# EAGLE design untitled (EAGLE 8.6.2)
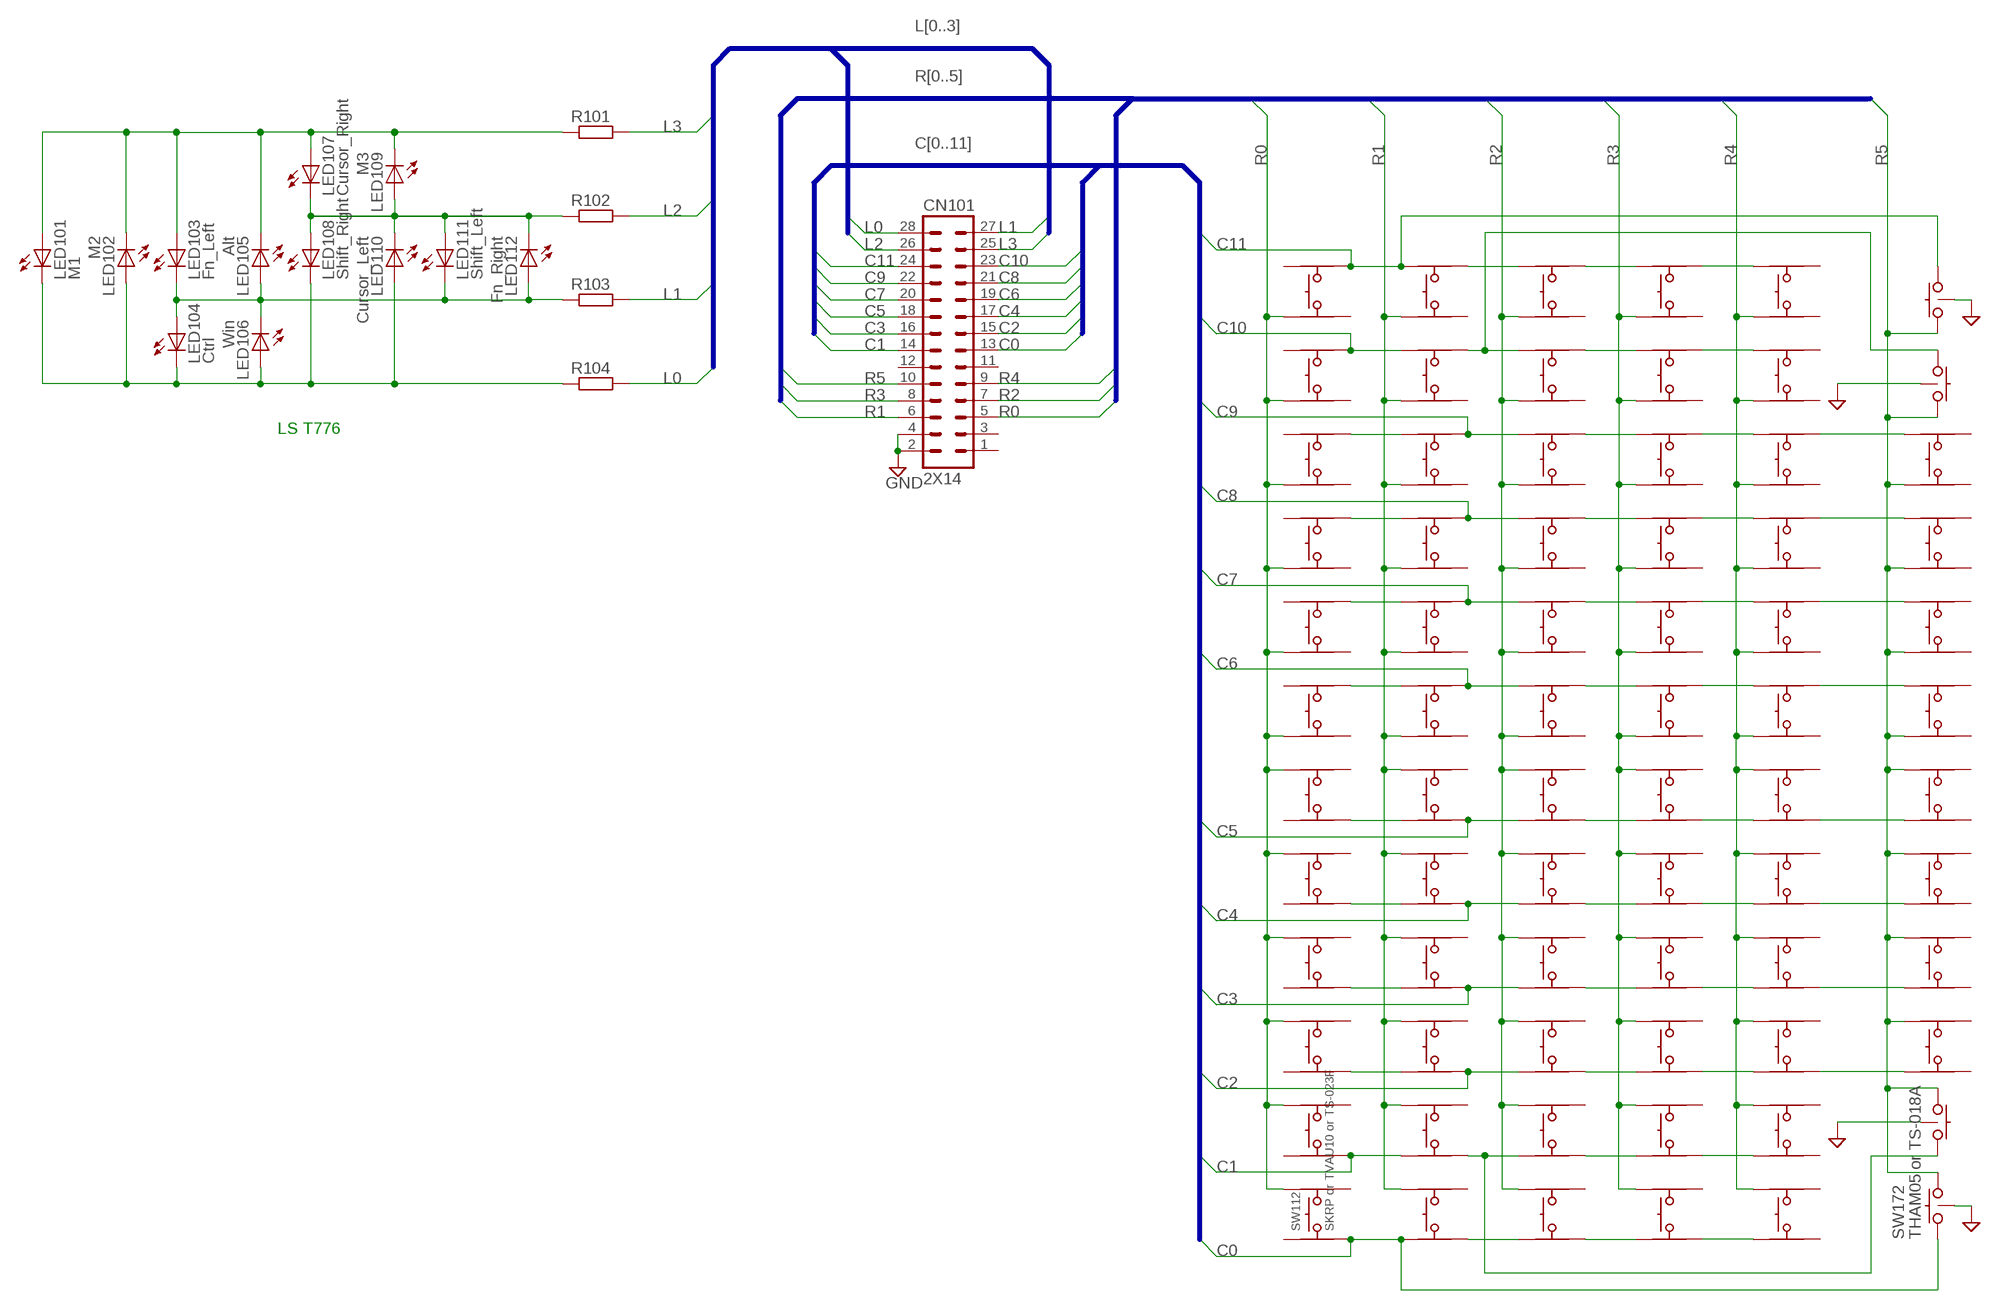
[diagram p0: schematic, sheet 1]

## Parts
CN101  2X14  [2MM_14X2]
LED101  M1  LEDP-LCC-2-BACK  [P-LCC-2-TOPLED-RG]
LED102  M2  LEDP-LCC-2-BACK  [P-LCC-2-TOPLED-RG]
LED103  Fn_Left  LEDP-LCC-2-BACK  [P-LCC-2-TOPLED-RG]
LED104  Ctrl  LEDP-LCC-2-BACK  [P-LCC-2-TOPLED-RG]
LED105  Alt  LEDP-LCC-2-BACK  [P-LCC-2-TOPLED-RG]
LED106  Win  LEDP-LCC-2-BACK  [P-LCC-2-TOPLED-RG]
LED107  Cursor_Right  LEDP-LCC-2-BACK  [P-LCC-2-TOPLED-RG]
LED108  Shift_Right  LEDP-LCC-2-BACK  [P-LCC-2-TOPLED-RG]
LED109  M3  LEDP-LCC-2-BACK  [P-LCC-2-TOPLED-RG]
LED110  Cursor_Left  LEDP-LCC-2-BACK  [P-LCC-2-TOPLED-RG]
LED111  Shift_Left  LEDP-LCC-2-BACK  [P-LCC-2-TOPLED-RG]
LED112  Fn_Right  LEDP-LCC-2-BACK  [P-LCC-2-TOPLED-RG]
R101  R-EU_R0402-SS  [R0402-SS]
R102  R-EU_R0402-SS  [R0402-SS]
R103  R-EU_R0402-SS  [R0402-SS]
R104  R-EU_R0402-SS  [R0402-SS]
SW101  SW_4PTVAU10-025  [TVAU10-025]
SW102  SW_4PTVAU10-025  [TVAU10-025]
SW103  SW_4PTVAU10-025  [TVAU10-025]
SW104  SW_4PTVAU10-025  [TVAU10-025]
SW105  SW_4PTVAU10-025  [TVAU10-025]
SW106  SW_4PTVAU10-025  [TVAU10-025]
SW107  SW_4PTVAU10-025  [TVAU10-025]
SW108  SW_4PTVAU10-025  [TVAU10-025]
SW109  SW_4PTVAU10-025  [TVAU10-025]
SW110  SW_4PTVAU10-025  [TVAU10-025]
SW111  SW_4PTVAU10-025  [TVAU10-025]
SW112  SKRP or TVAU10 or TS-023F  SW_4PTVAU10-025  [TVAU10-025]
SW113  SW_4PTVAU10-025  [TVAU10-025]
SW114  SW_4PTVAU10-025  [TVAU10-025]
SW115  SW_4PTVAU10-025  [TVAU10-025]
SW116  SW_4PTVAU10-025  [TVAU10-025]
SW117  SW_4PTVAU10-025  [TVAU10-025]
SW118  SW_4PTVAU10-025  [TVAU10-025]
SW119  SW_4PTVAU10-025  [TVAU10-025]
SW120  SW_4PTVAU10-025  [TVAU10-025]
SW121  SW_4PTVAU10-025  [TVAU10-025]
SW122  SW_4PTVAU10-025  [TVAU10-025]
SW123  SW_4PTVAU10-025  [TVAU10-025]
SW124  SW_4PTVAU10-025  [TVAU10-025]
SW125  SW_4PTVAU10-025  [TVAU10-025]
SW126  SW_4PTVAU10-025  [TVAU10-025]
SW127  SW_4PTVAU10-025  [TVAU10-025]
SW128  SW_4PTVAU10-025  [TVAU10-025]
SW129  SW_4PTVAU10-025  [TVAU10-025]
SW130  SW_4PTVAU10-025  [TVAU10-025]
SW131  SW_4PTVAU10-025  [TVAU10-025]
SW132  SW_4PTVAU10-025  [TVAU10-025]
SW133  SW_4PTVAU10-025  [TVAU10-025]
SW134  SW_4PTVAU10-025  [TVAU10-025]
SW135  SW_4PTVAU10-025  [TVAU10-025]
SW136  SW_4PTVAU10-025  [TVAU10-025]
SW137  SW_4PTVAU10-025  [TVAU10-025]
SW138  SW_4PTVAU10-025  [TVAU10-025]
SW139  SW_4PTVAU10-025  [TVAU10-025]
SW140  SW_4PTVAU10-025  [TVAU10-025]
SW141  SW_4PTVAU10-025  [TVAU10-025]
SW142  SW_4PTVAU10-025  [TVAU10-025]
SW143  SW_4PTVAU10-025  [TVAU10-025]
SW144  SW_4PTVAU10-025  [TVAU10-025]
SW145  SW_4PTVAU10-025  [TVAU10-025]
SW146  SW_4PTVAU10-025  [TVAU10-025]
SW147  SW_4PTVAU10-025  [TVAU10-025]
SW148  SW_4PTVAU10-025  [TVAU10-025]
SW149  SW_4PTVAU10-025  [TVAU10-025]
SW150  SW_4PTVAU10-025  [TVAU10-025]
SW151  SW_4PTVAU10-025  [TVAU10-025]
SW152  SW_4PTVAU10-025  [TVAU10-025]
SW153  SW_4PTVAU10-025  [TVAU10-025]
SW154  SW_4PTVAU10-025  [TVAU10-025]
SW155  SW_4PTVAU10-025  [TVAU10-025]
SW156  SW_4PTVAU10-025  [TVAU10-025]
SW157  SW_4PTVAU10-025  [TVAU10-025]
SW158  SW_4PTVAU10-025  [TVAU10-025]
SW159  SW_4PTVAU10-025  [TVAU10-025]
SW160  SW_4PTVAU10-025  [TVAU10-025]
SW161  SW_WITH_EARTHX  [THAM05]
SW162  SW_WITH_EARTHX  [THAM05]
SW163  SW_4PTVAU10-025  [TVAU10-025]
SW164  SW_4PTVAU10-025  [TVAU10-025]
SW165  SW_4PTVAU10-025  [TVAU10-025]
SW166  SW_4PTVAU10-025  [TVAU10-025]
SW167  SW_4PTVAU10-025  [TVAU10-025]
SW168  SW_4PTVAU10-025  [TVAU10-025]
SW169  SW_4PTVAU10-025  [TVAU10-025]
SW170  SW_4PTVAU10-025  [TVAU10-025]
SW171  SW_WITH_EARTHX  [THAM05]
SW172  THAM05 or TS-018A  SW_WITH_EARTHX  [THAM05]

## Nets
C0: CN101.13 SW112.P$2(=A) SW124.P$1(A) SW172.P$1
C1: CN101.14 SW111.P$2(=A) SW123.P$1(A)
C2: CN101.15 SW122.P$2(=A) SW134.P$1(A)
C3: CN101.16 SW121.P$2(=A) SW133.P$1(A)
C4: CN101.17 SW120.P$2(=A) SW132.P$1(A)
C5: CN101.18 SW119.P$2(=A) SW131.P$1(A)
C6: CN101.19 SW118.P$4(=B) SW130.P$3(B)
C7: CN101.20 SW117.P$4(=B) SW129.P$3(B)
C8: CN101.21 SW116.P$4(=B) SW128.P$3(B)
C9: CN101.22 SW115.P$4(=B) SW127.P$3(B)
C10: CN101.23 SW102.P$4(=B) SW114.P$3(B)
C11: CN101.24 SW101.P$4(=B) SW113.P$3(B) SW161.P$2
GND: CN101.2 CN101.4 SW161.S1 SW161.S2 SW161.S3 SW161.S4 SW161.S5 SW162.S1 SW162.S2 SW162.S3 SW162.S4 SW162.S5 SW171.S1 SW171.S2 SW171.S3 SW171.S4 SW171.S5 SW172.S1 SW172.S2 SW172.S3 SW172.S4 SW172.S5
L0: CN101.28 R104.2
L1: CN101.27 R103.2
L2: CN101.26 R102.2
L3: CN101.25 R101.2
N$1: LED107.C LED108.A LED109.A LED110.C LED111.A LED112.C R102.1
N$2: LED101.A LED102.C LED103.A LED105.C LED107.A LED109.C R101.1
N$3: LED103.C LED104.A LED105.A LED106.C LED111.C LED112.A R103.1
N$4: LED101.C LED102.A LED104.C LED106.A LED108.C LED110.A R104.1
N$5: SW123.P$2(=A) SW135.P$1(A) SW171.P$2
N$6: SW113.P$4(=B) SW125.P$3(B)
N$7: SW114.P$4(=B) SW126.P$3(B) SW162.P$1
N$9: SW106.P$4(=B) SW118.P$3(B)
N$10: SW130.P$4(=B) SW142.P$3(B)
N$11: SW154.P$4(=B) SW166.P$3(B)
N$12: SW142.P$4(=B) SW154.P$3(B)
N$13: SW105.P$4(=B) SW117.P$3(B)
N$14: SW129.P$4(=B) SW141.P$3(B)
N$15: SW153.P$4(=B) SW165.P$3(B)
N$16: SW141.P$4(=B) SW153.P$3(B)
N$17: SW104.P$4(=B) SW116.P$3(B)
N$18: SW128.P$4(=B) SW140.P$3(B)
N$19: SW152.P$4(=B) SW164.P$3(B)
N$20: SW140.P$4(=B) SW152.P$3(B)
N$21: SW103.P$4(=B) SW115.P$3(B)
N$22: SW127.P$4(=B) SW139.P$3(B)
N$23: SW151.P$4(=B) SW163.P$3(B)
N$24: SW139.P$4(=B) SW151.P$3(B)
N$26: SW126.P$4(=B) SW138.P$3(B)
N$28: SW138.P$4(=B) SW150.P$3(B)
N$30: SW125.P$4(=B) SW137.P$3(B)
N$32: SW137.P$4(=B) SW149.P$3(B)
N$41: SW107.P$2(=A) SW119.P$1(A)
N$43: SW131.P$2(=A) SW143.P$1(A)
N$44: SW155.P$2(=A) SW167.P$1(A)
N$45: SW143.P$2(=A) SW155.P$1(A)
N$46: SW108.P$2(=A) SW120.P$1(A)
N$48: SW132.P$2(=A) SW144.P$1(A)
N$49: SW156.P$2(=A) SW168.P$1(A)
N$50: SW144.P$2(=A) SW156.P$1(A)
N$51: SW109.P$2(=A) SW121.P$1(A)
N$53: SW133.P$2(=A) SW145.P$1(A)
N$54: SW157.P$2(=A) SW169.P$1(A)
N$55: SW145.P$2(=A) SW157.P$1(A)
N$56: SW110.P$2(=A) SW122.P$1(A)
N$58: SW134.P$2(=A) SW146.P$1(A)
N$59: SW158.P$2(=A) SW170.P$1(A)
N$60: SW146.P$2(=A) SW158.P$1(A)
N$68: SW135.P$2(=A) SW147.P$1(A)
N$70: SW147.P$2(=A) SW159.P$1(A)
N$72: SW124.P$2(=A) SW136.P$1(A)
N$73: SW136.P$2(=A) SW148.P$1(A)
N$75: SW148.P$2(=A) SW160.P$1(A)
R0: CN101.5 SW101.P$1(A) SW102.P$1(A) SW103.P$1(A) SW104.P$1(A) SW105.P$1(A) SW106.P$1(A) SW107.P$3(B) SW108.P$3(B) SW109.P$3(B) SW110.P$3(B) SW111.P$3(B) SW112.P$3(B)
R1: CN101.6 SW113.P$1(A) SW114.P$1(A) SW115.P$1(A) SW116.P$1(A) SW117.P$1(A) SW118.P$1(A) SW119.P$3(B) SW120.P$3(B) SW121.P$3(B) SW122.P$3(B) SW123.P$3(B) SW124.P$3(B)
R2: CN101.7 SW125.P$1(A) SW126.P$1(A) SW127.P$1(A) SW128.P$1(A) SW129.P$1(A) SW130.P$1(A) SW131.P$3(B) SW132.P$3(B) SW133.P$3(B) SW134.P$3(B) SW135.P$3(B) SW136.P$3(B)
R3: CN101.8 SW137.P$1(A) SW138.P$1(A) SW139.P$1(A) SW140.P$1(A) SW141.P$1(A) SW142.P$1(A) SW143.P$3(B) SW144.P$3(B) SW145.P$3(B) SW146.P$3(B) SW147.P$3(B) SW148.P$3(B)
R4: CN101.9 SW149.P$1(A) SW150.P$1(A) SW151.P$1(A) SW152.P$1(A) SW153.P$1(A) SW154.P$1(A) SW155.P$3(B) SW156.P$3(B) SW157.P$3(B) SW158.P$3(B) SW159.P$3(B) SW160.P$3(B)
R5: CN101.10 SW161.P$1 SW162.P$2 SW163.P$1(A) SW164.P$1(A) SW165.P$1(A) SW166.P$1(A) SW167.P$3(B) SW168.P$3(B) SW169.P$3(B) SW170.P$3(B) SW171.P$1 SW172.P$2
Unconnected: CN101.1 CN101.3 CN101.11 CN101.12 SW101.P$2(=A) SW101.P$3(B) SW102.P$2(=A) SW102.P$3(B) SW103.P$2(=A) SW103.P$3(B) SW104.P$2(=A) SW104.P$3(B) SW105.P$2(=A) SW105.P$3(B) SW106.P$2(=A) SW106.P$3(B) SW107.P$1(A) SW107.P$4(=B) SW108.P$1(A) SW108.P$4(=B) SW109.P$1(A) SW109.P$4(=B) SW110.P$1(A) SW110.P$4(=B) SW111.P$1(A) SW111.P$4(=B) SW112.P$1(A) SW112.P$4(=B) SW113.P$2(=A) SW114.P$2(=A) SW115.P$2(=A) SW116.P$2(=A) SW117.P$2(=A) SW118.P$2(=A) SW119.P$4(=B) SW120.P$4(=B) SW121.P$4(=B) SW122.P$4(=B) SW123.P$4(=B) SW124.P$4(=B) SW125.P$2(=A) SW126.P$2(=A) SW127.P$2(=A) SW128.P$2(=A) SW129.P$2(=A) SW130.P$2(=A) SW131.P$4(=B) SW132.P$4(=B) SW133.P$4(=B) SW134.P$4(=B) SW135.P$4(=B) SW136.P$4(=B) SW137.P$2(=A) SW138.P$2(=A) SW139.P$2(=A) SW140.P$2(=A) SW141.P$2(=A) SW142.P$2(=A) SW143.P$4(=B) SW144.P$4(=B) SW145.P$4(=B) SW146.P$4(=B) SW147.P$4(=B) SW148.P$4(=B) SW149.P$2(=A) SW149.P$4(=B) SW150.P$2(=A) SW150.P$4(=B) SW151.P$2(=A) SW152.P$2(=A) SW153.P$2(=A) SW154.P$2(=A) SW155.P$4(=B) SW156.P$4(=B) SW157.P$4(=B) SW158.P$4(=B) SW159.P$2(=A) SW159.P$4(=B) SW160.P$2(=A) SW160.P$4(=B) SW163.P$2(=A) SW163.P$4(=B) SW164.P$2(=A) SW164.P$4(=B) SW165.P$2(=A) SW165.P$4(=B) SW166.P$2(=A) SW166.P$4(=B) SW167.P$2(=A) SW167.P$4(=B) SW168.P$2(=A) SW168.P$4(=B) SW169.P$2(=A) SW169.P$4(=B) SW170.P$2(=A) SW170.P$4(=B)

## Buses
C[0..11]
R[0..5]
L[0..3]

## Notes on the sheet
- LS T776

## Library data of the parts
CN101 = 4 _ll_ll_:2X14
LED101-LED112 = 8 LED:LED: LED OSRAM: - CHIPLED LG R971, LG N971, LY N971, LG Q971, LY Q971, LO R971, LY R971 LH N974, LH R974 LS Q976, LO Q976, LY Q976 LO Q996 - Hyper CHIPLED LW Q18S LB Q993, LB Q99A, LB R99A - SideLED LS A670, LO A670, LY A670, LG A670, LP A670 LB A673, LV A673, LT A673, LW A673 LH A674 LY A675 LS A676, LA A676, LO A676, LY A676, LW A676 LS A679, LY A679, LG A679 - Hyper Micro SIDELED® LS Y876, LA Y876, LO Y876, LY Y876 LT Y87S - SmartLED LW L88C, LW L88S LB L89C, LB L89S, LG L890 LS L89K, LO L89K, LY L89K LS L896, LA L896, LO L896, LY L896 - TOPLED LS T670, LO T670, LY T670, LG T670, LP T670 LSG T670, LSP T670, LSY T670, LOP T670, LYG T670 LG T671, LOG T671, LSG T671 LB T673, LV T673, LT T673, LW T673 LH T674 LS T676, LA T676, LO T676, LY T676, LB T676, LH T676, LSB T676, LW T676 LB T67C, LV T67C, LT T67C, LS T67K, LO T67K, LY T67K, LW E67C LS E67B, LA E67B, LO E67B, LY E67B, LB E67C, LV E67C, LT E67C LW T67C LS T679, LY T679, LG T679 LS T770, LO T770, LY T770, LG T770, LP T770 LB T773, LV T773, LT T773, LW T773 LH T774 LS E675, LA E675, LY E675, LS T675 LS T776, LA T776, LO T776, LY T776, LB T776 LHGB T686 LT T68C, LB T68C - Hyper Mini TOPLED® LB M676 - Mini TOPLED Santana® LG M470 LS M47K, LO M47K, LY M47K Source: http://www.osram.convergy.de - LUMILED® LXK2-PW12-R00, LXK2-PW12-S00, LXK2-PW14-U00, LXK2-PW14-V00 LXK2-PM12-R00, LXK2-PM12-S00, LXK2-PM14-U00 LXK2-PE12-Q00, LXK2-PE12-R00, LXK2-PE12-S00, LXK2-PE14-T00, LXK2-PE14-U00 LXK2-PB12-K00, LXK2-PB12-L00, LXK2-PB12-M00, LXK2-PB14-N00, LXK2-PB14-P00, LXK2-PB14-Q00 LXK2-PR12-L00, LXK2-PR12-M00, LXK2-PR14-Q00, LXK2-PR14-R00 LXK2-PD12-Q00, LXK2-PD12-R00, LXK2-PD12-S00 LXK2-PH12-R00, LXK2-PH12-S00 LXK2-PL12-P00, LXK2-PL12-Q00, LXK2-PL12-R00 Source: www.luxeon.com
R101-R104 = 2 RCL:R-EU_: RESISTOR, European symbol
SW101-SW160 SW163-SW170 = 0 my parts:SW_4P
SW161 SW162 SW171 SW172 = 0 my parts:SW_WITH_EARTH

## Board
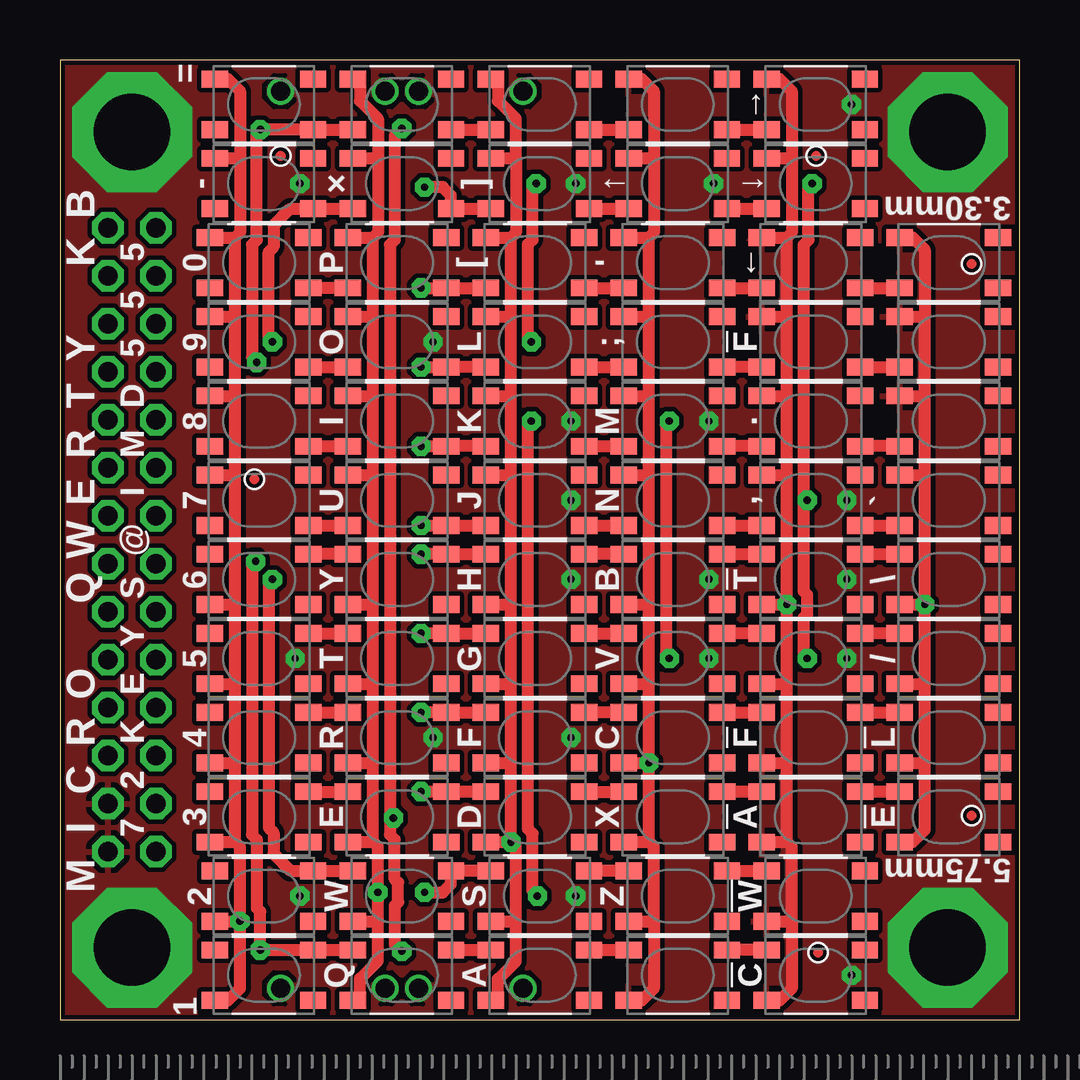
[diagram p1: board, top side]
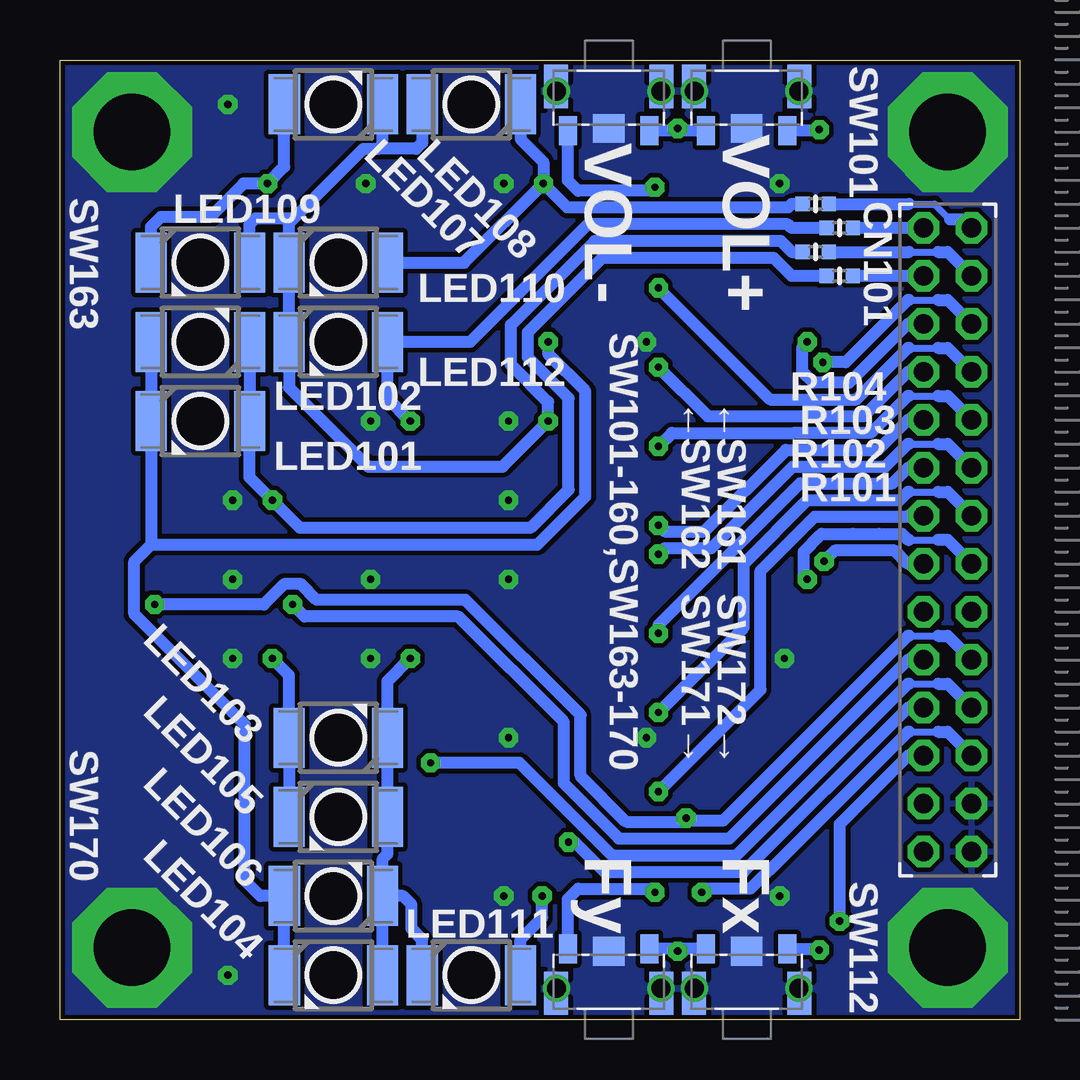
[diagram p2: board, bottom side, seen from below]

Size 40 x 40 mm. Coordinates in mm from the lower left corner, seen from the top.
Outline: 0,0 40,0 40,40 0,40 0,0
Copper layers (1*16): Top 0.035mm / dielectric 1.5mm / Bottom 0.035mm
Design rules "SeeedStudio_2layer_DRU_no_angle_20140221_IMD555 *": minimum track width 0.2mm, minimum drill 0.3mm, track to track 0.2mm, track to pad 0.2mm, pad to pad 0.2mm, via to via 0.2mm, smd to smd 0mil, copper to edge 0.2mm, drill to drill 10mil, minimum pad ring 0.16mm, minimum via ring 0.2mm, stop-mask expansion 0.03mm, vias tented up to drill 5mm, thermal gap 10mil
tRestrict: area 22.1,1.1 to 23.7,2.7; area 27.8,1.1 to 29.4,2.7; area 27.8,4.4 to 29.4,6; area 27.6,7.6 to 29.2,9.2; area 27.6,10.9 to 29.2,12.6; area 33.4,27.4 to 34.9,29.1; area 33.4,30.8 to 34.9,32.4; area 22.1,37.4 to 23.7,38.9; area 27.8,37.4 to 29.4,38.9; area 33.4,24.1 to 34.9,25.8; area 27.6,27.4 to 29.2,29.1; area 27.6,30.8 to 29.2,32.4

### Footprints (pad centres in the part's own frame; a part is rotated, then mirrored left to right if it is on the bottom)
2MM_14X2 = drill 0.8 pad 1.3 octagon: 1 13,-1; 2 13,1; 3 11,-1; 4 11,1; 5 9,-1; 6 9,1; 7 7,-1; 8 7,1; 9 5,-1; 10 5,1; 11 3,-1; 12 3,1; 13 1,-1; 14 1,1; 15 -1,-1; 16 -1,1; 17 -3,-1; 18 -3,1; 19 -5,-1; 20 -5,1; 21 -7,-1; 22 -7,1; 23 -9,-1; 24 -9,1; 25 -11,-1; 26 -11,1; 27 -13,-1; 28 -13,1
P-LCC-2-TOPLED-RG = smd 2.5 x 1.3: A 0,2.05; C 0,-2.05
R0402-SS = smd 0.6 x 0.6: 1 -0.55,0; 2 0.55,0
TVAU10-025 = smd 1.1 x 0.7: P$1 -2.05,1.05; P$2 2.05,1.05; P$3 -2.05,-1.05; P$4 2.05,-1.05
THAM05 = smd 0.75 x 1.2: P$1 -1.7,-1.65; P$2 1.7,-1.65 | drill 0.8 pad 0.8: S1 -2.175,0; S2 2.175,0 | smd 1.3 x 1.2: S3 0,-1.55 | smd 1 x 1.8: S4 -2.2,0.2; S5 2.2,0.2

### Placement (x,y rotation side)
CN101  3,20 270 bottom
LED101  34.15,24.95 270 bottom
LED102  34.15,28.25 90 bottom
LED103  28.4,11.75 90 bottom
LED104  28.6,1.85 270 bottom
LED105  28.4,8.45 270 bottom
LED106  28.6,5.15 90 bottom
LED107  28.6,38.15 90 bottom
LED108  22.85,38.15 90 bottom
LED109  34.15,31.55 270 bottom
LED110  28.4,31.55 270 bottom
LED111  22.85,1.85 270 bottom
LED112  28.4,28.25 270 bottom
R101  7.5,31 0 bottom
R102  8.5,32 0 bottom
R103  7.5,33 0 bottom
R104  8.5,34 0 bottom
SW101  8.5,38.15 0 top
SW102  8.5,34.85 0 top
SW103  8.3,31.55 0 top
SW104  8.3,28.25 0 top
SW105  8.3,24.95 0 top
SW106  8.3,21.65 0 top
SW107  8.3,18.35 0 top
SW108  8.3,15.05 0 top
SW109  8.3,11.75 0 top
SW110  8.3,8.45 0 top
SW111  8.5,5.15 0 top
SW112  8.5,1.85 0 top
SW113  14.25,38.15 0 top
SW114  14.25,34.85 0 top
SW115  14.05,31.55 0 top
SW116  14.05,28.25 0 top
SW117  14.05,24.95 0 top
SW118  14.05,21.65 0 top
SW119  14.05,18.35 0 top
SW120  14.05,15.05 0 top
SW121  14.05,11.75 0 top
SW122  14.05,8.45 0 top
SW123  14.25,5.15 0 top
SW124  14.25,1.85 0 top
SW125  20,38.15 0 top
SW126  20,34.85 0 top
SW127  19.8,31.55 0 top
SW128  19.8,28.25 0 top
SW129  19.8,24.95 0 top
SW130  19.8,21.65 0 top
SW131  19.8,18.35 0 top
SW132  19.8,15.05 0 top
SW133  19.8,11.75 0 top
SW134  19.8,8.45 0 top
SW135  20,5.15 0 top
SW136  20,1.85 0 top
SW137  25.75,38.15 0 top
SW138  25.75,34.85 0 top
SW139  25.55,31.55 0 top
SW140  25.55,28.25 0 top
SW141  25.55,24.95 0 top
SW142  25.55,21.65 0 top
SW143  25.55,18.35 0 top
SW144  25.55,15.05 0 top
SW145  25.55,11.75 0 top
SW146  25.55,8.45 0 top
SW147  25.75,5.15 0 top
SW148  25.75,1.85 0 top
SW149  31.5,38.15 0 top
SW150  31.5,34.85 0 top
SW151  31.3,31.55 0 top
SW152  31.3,28.25 0 top
SW153  31.3,24.95 0 top
SW154  31.3,21.65 0 top
SW155  31.3,18.35 0 top
SW156  31.3,15.05 0 top
SW157  31.3,11.75 0 top
SW158  31.3,8.45 0 top
SW159  31.5,5.15 0 top
SW160  31.5,1.85 0 top
SW161  11.38,38.7 0 bottom
SW162  17.12,38.7 0 bottom
SW163  37.05,31.55 0 top
SW164  37.05,28.25 0 top
SW165  37.05,24.95 0 top
SW166  37.05,21.65 0 top
SW167  37.05,18.35 0 top
SW168  37.05,15.05 0 top
SW169  37.05,11.75 0 top
SW170  37.05,8.45 0 top
SW171  17.12,1.3 180 bottom
SW172  11.38,1.3 180 bottom
U$1  [PCB_CHECK]  9.2,36 0 top
U$2  [RULER-S]  0,-4.5 0 top  (outside the outline)
U$3  [RULER-S]  -4.5,0 90 bottom  (outside the outline)
U$4  [PCB_CHECK]  31.6,2.8 0 top
U$5  [PCB_CHECK]  31.53,36.01 0 top
U$6  [PCB_CHECK]  38,31.5 0 top
U$7  [PCB_CHECK]  38,8.5 0 top
U$8  [PCB_CHECK]  8.1,22.52 0 top

### Tracks (layer width: path | path; a pad name or v marks a point on that pad's centre or on a via)
C0  (via drill 0.3 pad 0.8)
  Top 0.5: SW124.P$1 SW112.P$2 v8.35,2.9 8.35,4.5 8.2,4.65 8.2,7.5 8,7.7 8,18.95 v8.15,19.1
  Bottom 0.5: CN101.13 4.65,19 5.2,19.55 7.7,19.55 v8.15,19.1 | SW172.P$1 8.4,2.95 v8.35,2.9
C1  (via drill 0.3 pad 0.8)
  Top 0.5: SW123.P$1 SW111.P$2 9.6,6.2 8.9,6.9 8.9,7.8 8.7,8 8.7,18.2 v8.85,18.35
  Bottom 0.3: 4.6,20 3.4,20
  Bottom 0.5: v8.85,18.35 9,18.5 9,19.5 8.3,20.2 8.25,20.25 6.95,20.25 5.85,20.25 4.9,20.25 4.85,20.2 4.65,20 4.6,20 | 3.4,20 3,20 CN101.14
C2  (via drill 0.3 pad 0.8)
  Top 0.5: SW134.P$1 SW122.P$2 v15.05,9.5
  Bottom 0.5: v15.05,9.5 10.8,13.75 10.8,18.7 8.55,20.95 4.7,20.95 4.65,21 CN101.15
C3  (via drill 0.3 pad 0.8)
  Top 0.5: SW133.P$1 SW121.P$2 v15.05,12.8
  Bottom 0.3: 4.6,22 3.4,22
  Bottom 0.5: v15.05,12.8 11.5,16.35 11.5,19 8.85,21.65 5,21.65 4.65,22 4.6,22 | CN101.16 3,22 3.4,22
C4  (via drill 0.3 pad 0.8)
  Top 0.5: SW132.P$1 SW120.P$2 v15.05,16.1
  Bottom 0.5: CN101.17 4.65,23 5.3,22.35 9.15,22.35 15.05,16.45 v15.05,16.1
C5  (via drill 0.3 pad 0.8)
  Top 0.5: SW131.P$1 SW119.P$2 v15.05,19.4
  Bottom 0.3: 4.6,24 3.4,24
  Bottom 0.5: CN101.18 3,24 3.4,24 | 4.6,24 4.65,24 5.6,23.05 9.45,23.05 12.85,19.65 14.8,19.65 v15.05,19.4
C6  (via drill 0.3 pad 0.8)
  Top 0.5: SW130.P$3 SW118.P$4 v15.05,20.6
  Bottom 0.5: CN101.19 4.65,25 5.9,23.75 9.75,23.75 13.15,20.35 14.8,20.35 v15.05,20.6
C7  (via drill 0.3 pad 0.8)
  Top 0.5: SW129.P$3 SW117.P$4 v15.05,23.9
  Bottom 0.3: 4.6,26 3.4,26
  Bottom 0.5: CN101.20 3,26 3.4,26 | 4.6,26 4.65,26 6.2,24.45 9.4,24.45 14.5,24.45 v15.05,23.9
C8  (via drill 0.3 pad 0.8)
  Top 0.5: SW128.P$3 SW116.P$4 v15.05,27.2
  Bottom 0.5: CN101.21 4.65,27 6.5,25.15 13,25.15 v15.05,27.2
C9  (via drill 0.3 pad 0.8)
  Top 0.5: SW127.P$3 SW115.P$4 v15.05,30.5
  Bottom 0.3: 4.6,28 3.4,28
  Bottom 0.5: CN101.22 3,28 3.4,28 | 4.6,28 4.65,28 6.8,25.85 10.4,25.85 v15.05,30.5
C10  (via drill 0.3 pad 0.8)
  Top 0.5: v8.85,28.25 8.7,28.4 8.7,32 8.9,32.2 8.9,33.1 9.6,33.8 SW102.P$4 SW114.P$3
  Bottom 0.5: CN101.23 4.65,29 7.1,26.55 8.6,26.55 9.05,27 9.05,28.05 v8.85,28.25
C11  (via drill 0.3 pad 0.8)
  Top 0.5: v8.2,27.4 8,27.6 8,32.3 8.2,32.5 8.2,36.95 v8.35,37.1 SW101.P$4 SW113.P$3
  Bottom 0.3: 4.6,30 3.4,30
  Bottom 0.5: CN101.24 3,30 3.4,30 | 4.6,30 4.65,30 7.25,27.4 v8.2,27.4 | v8.35,37.1 8.4,37.05 SW161.P$2
GND  (via drill 0.3 pad 0.8, 3.2 pad 5)
  other vias: 9.8,15.05 10,5.15 27.05,15.05 32.8,18.35 27.05,24.95 21.3,18.35 21.3,24.95 32.8,15.05 21.3,11.75 27.05,18.35 32.8,21.65 21.3,21.65 15.55,11.75 21.5,34.85 3,37 37,37 37,3 3,3 10,34.85 15.55,28.25 21.5,5.15 27.25,34.85 33,38.15 33,1.85
  pour Bottom: 0,40 40,40 40,0 0,0
  pour Top (rank 2): 0,40 40,40 40,0 0,0
L0
  Bottom 0.3: 4.6,34 3.55,34 2.9,33.35
  Bottom 0.5: CN101.28 2.35,33.35 2.9,33.35 | R104.2 4.6,34
L1
  Bottom 0.5: 4.6,33 CN101.27 R103.2
L2
  Bottom 0.3: 4.6,32 3.4,32
  Bottom 0.5: CN101.26 3,32 3.4,32 | R102.2 4.6,32
L3
  Bottom 0.5: CN101.25 R101.2
N$1  (via drill 0.3 pad 0.8)
  Top 0.5: v19.65,24.95 19.5,24.8 19.5,7.95 19.7,7.75 19.7,5.35 v19.9,5.15
  Bottom 0.5: LED107.C 26.55,36.5 26.75,36.3 | R102.1 9.5,32 9.95,32.45 17.7,32.45 21.2,28.95 21.2,27.3 19.65,25.75 v19.65,24.95 21.55,23.05 27.15,23.05 30.45,26.35 LED112.C LED110.C 30.45,33.2 30.25,33.4 | 30.25,33.4 27.35,36.3 26.75,36.3 | LED111.A 20.8,3.35 19.9,4.25 v19.9,5.15 | LED108.A 24.9,36.55 25.15,36.3 26.75,36.3 | LED109.A 32.1,33.15 31.85,33.4 30.25,33.4
N$2  (via drill 0.3 pad 0.8)
  Top 0.5: v31.15,15.05 31,15.2 31,16.75 31.15,16.9 31.15,17.7 31,17.85 31,21.5 v31.15,21.65 31,21.8 31,32.3 31.2,32.5 31.2,34.7 v31.35,34.85
  Bottom 0.5: LED102.C LED101.A 32.1,22.6 v31.15,21.65 30,20.5 20.39,20.5 18.8,22.09 18.8,25.9 20.5,27.6 20.5,28.65 17.4,31.75 10.25,31.75 9.5,31 R101.1 | LED105.C LED103.A 30.45,14.35 v31.15,15.05 | LED107.A 30.65,35.55 v31.35,34.85 32.35,34.85 33.75,33.45 35.8,33.45 36.2,33.05 LED109.C
N$3  (via drill 0.3 pad 0.8)
  Top 0.5: v25.4,24.95 25.25,24.8 25.25,15.2 v25.4,15.05
  Bottom 0.5: LED104.A LED106.C | LED106.C 26.55,6.7 26.35,6.9 LED105.A LED103.C 26.35,14.1 v25.4,15.05 | v25.4,24.95 26.35,25.9 LED112.A 22.9,28.25 18,33.15 9.66,33.15 9.51,33 R103.1 | LED111.C 24.9,3.35 25.35,3.8 25.35,4.8 25.7,5.15 LED106.C
N$4  (via drill 0.3 pad 0.8)
  Top 0.5: v19.65,28.25 19.5,28.4 19.5,32.31 19.7,32.51 19.7,34.7 v19.85,34.85
  Bottom 0.5: LED102.A LED101.C 36.2,19.8 | LED104.C LED106.A 31.65,5.15 32.3,5.8 32.3,12.3 36.9,16.9 36.9,19.1 36.2,19.8 | LED110.A 23.15,31.55 v19.85,34.85 | v19.65,28.25 19.65,27.74 18.1,26.19 18.1,21.8 20.1,19.8 36.2,19.8 | R104.1 9.5,34 9.65,33.85 18.85,33.85 v19.85,34.85 | LED108.C 20.8,36.7 19.85,35.75 v19.85,34.85
N$5  (via drill 0.3 pad 0.8)
  Top 0.5: SW135.P$1 SW123.P$2 16.3,5.65 15.95,5.3 v15.2,5.3
  Bottom 0.5: SW171.P$2 18.82,5.03 18.4,5.45 15.35,5.45 v15.2,5.3
N$6
  Top 0.5: SW113.P$4 SW125.P$3
N$7  (via drill 0.3 pad 0.8)
  Top 0.5: SW126.P$3 SW114.P$4 16.3,34.35 15.95,34.7 v15.2,34.7
  Bottom 0.5: v15.2,34.7 15.35,34.55 18.4,34.55 18.82,34.98 SW162.P$1
N$9
  Top 0.5: SW106.P$4 SW118.P$3
N$10
  Top 0.5: SW130.P$4 SW142.P$3
N$11
  Top 0.5: SW154.P$4 SW166.P$3
N$12
  Top 0.5: SW142.P$4 SW154.P$3
N$13
  Top 0.5: SW105.P$4 SW117.P$3
N$14
  Top 0.5: SW129.P$4 SW141.P$3
N$15
  Top 0.5: SW165.P$3 SW153.P$4
N$16
  Top 0.5: SW153.P$3 SW141.P$4
N$17
  Top 0.5: SW104.P$4 SW116.P$3
N$18
  Top 0.5: SW128.P$4 SW140.P$3
N$19
  Top 0.5: SW152.P$4 SW164.P$3
N$20
  Top 0.5: SW152.P$3 SW140.P$4
N$21
  Top 0.5: SW115.P$3 SW103.P$4
N$22
  Top 0.5: SW127.P$4 SW139.P$3
N$23
  Top 0.5: SW151.P$4 SW163.P$3
N$24
  Top 0.5: SW139.P$4 SW151.P$3
N$26
  Top 0.5: SW126.P$4 SW138.P$3
N$28
  Top 0.5: SW138.P$4 SW150.P$3
N$30
  Top 0.5: SW125.P$4 SW137.P$3
N$32
  Top 0.5: SW137.P$4 SW149.P$3
N$41
  Top 0.5: SW119.P$1 SW107.P$2
N$43
  Top 0.5: SW143.P$1 SW131.P$2
N$44
  Top 0.5: SW155.P$2 SW167.P$1
N$45
  Top 0.5: SW143.P$2 SW155.P$1
N$46
  Top 0.5: SW108.P$2 SW120.P$1
N$48
  Top 0.5: SW132.P$2 SW144.P$1
N$49
  Top 0.5: SW168.P$1 SW156.P$2
N$50
  Top 0.5: SW156.P$1 SW144.P$2
N$51
  Top 0.5: SW109.P$2 SW121.P$1
N$53
  Top 0.5: SW145.P$1 SW133.P$2
N$54
  Top 0.5: SW157.P$2 SW169.P$1
N$55
  Top 0.5: SW145.P$2 SW157.P$1
N$56
  Top 0.5: SW110.P$2 SW122.P$1
N$58
  Top 0.5: SW134.P$2 SW146.P$1
N$59
  Top 0.5: SW170.P$1 SW158.P$2
N$60
  Top 0.5: SW158.P$1 SW146.P$2
N$68
  Top 0.5: SW147.P$1 SW135.P$2
N$70
  Top 0.5: SW147.P$2 SW159.P$1
N$72
  Top 0.5: SW124.P$2 SW136.P$1
N$73
  Top 0.5: SW136.P$2 SW148.P$1
N$75
  Top 0.5: SW160.P$1 SW148.P$2
R0  (via drill 0.3 pad 0.8)
  Top 0.5: SW111.P$3 v7.5,4.1 | v7.5,4.1 7.5,1.3 7,0.8 SW112.P$3 | v7.5,4.1 7.5,7.2 7.3,7.4 | 7.3,7.4 7.3,10.7 | 7.3,29.3 7.3,32.6 | 7.3,32.6 7.5,32.8 7.5,35.9 | SW107.P$3 7.3,17.3 | 7.3,17.3 7.3,22.7 | 7.3,26 7.3,23.2 7.3,22.7 | SW108.P$3 7.3,14 | 7.3,14 7.3,17.3 | SW109.P$3 7.3,10.7 | 7.3,10.7 7.3,14 | SW110.P$3 7.3,7.4 | SW104.P$1 7.3,29.3 | SW105.P$1 7.3,26 | 7.3,26 7.3,29.3 | SW103.P$1 7.3,32.6 | SW101.P$1 7,39.2 7.5,38.7 7.5,35.9 | SW102.P$1 7.5,35.9 | SW106.P$1 7.3,22.7
  Bottom 0.5: CN101.5 4.65,11 7.5,8.15 v7.5,4.1
R1  (via drill 0.3 pad 0.8)
  Top 0.5: SW123.P$3 13.25,4.1 v13.25,5.3 | v13.25,5.3 13.25,7.2 13.05,7.4 | 13.05,7.4 13.05,10.7 | 13.05,22.7 13.05,26 | 13.05,26 13.05,29.3 | 13.05,29.3 13.05,32.6 | 13.05,32.6 13.25,32.8 13.25,35.9 | SW119.P$3 13.05,17.3 | 13.05,17.3 13.05,22.7 | SW120.P$3 13.05,14 | 13.05,14 13.05,17.3 | SW121.P$3 13.05,10.7 | 13.05,10.7 13.05,14 | SW122.P$3 13.05,7.4 | SW118.P$1 13.05,22.7 | SW117.P$1 13.05,26 | SW116.P$1 13.05,29.3 | SW115.P$1 13.05,32.6 | SW114.P$1 13.25,35.9 | SW113.P$1 12.5,38.9 12.5,38.3 13.25,37.55 13.25,35.9 | v13.25,5.3 13.25,2.45 12.5,1.7 12.5,1.1 SW124.P$3
  Bottom 0.3: 4.6,12 3.4,12
  Bottom 0.5: 4.6,12 4.65,12 10.45,6.2 10.47,6.2 11.22,5.45 13.1,5.45 v13.25,5.3 | CN101.6 3,12 3.4,12
R2  (via drill 0.3 pad 0.8)
  Top 0.5: SW135.P$3 19,4.1 | 19,4.1 19,7.2 v18.8,7.4 | v18.8,7.4 18.8,10.7 | 18.8,29.3 18.8,32.6 | 18.8,32.6 19,32.8 19,35.9 | SW131.P$3 18.8,17.3 | 18.8,17.3 18.8,22.7 | 18.8,22.7 18.8,26 | 18.8,26 18.8,29.3 | SW132.P$3 18.8,14 | 18.8,14 18.8,17.3 | SW133.P$3 18.8,10.7 | 18.8,10.7 18.8,14 | SW134.P$3 v18.8,7.4 | SW128.P$1 18.8,29.3 | SW129.P$1 18.8,26 | SW130.P$1 18.8,22.7 | SW127.P$1 18.8,32.6 | SW126.P$1 19,35.9 | SW125.P$1 18.25,38.9 18.25,38.3 19,37.55 19,35.9 | SW136.P$3 18.25,1.1 18.25,1.69 19,2.44 19,4.1
  Bottom 0.5: 8.05,9.6 6.2,11.45 | 6.2,11.45 4.65,13 CN101.7 | v18.8,7.4 18.55,7.4 17.3,6.15 11.51,6.15 6.21,11.45 6.2,11.45
R3  (via drill 0.3 pad 0.8)
  Top 0.5: SW147.P$3 24.75,4.1 | 24.75,4.1 24.75,7.2 24.55,7.4 | 24.55,7.4 v24.55,10.7 | 24.55,22.7 24.55,26 | 24.55,26 24.55,29.3 | 24.55,29.3 24.55,32.6 | 24.55,32.6 24.75,32.8 24.75,35.9 | SW143.P$3 24.55,17.3 | 24.55,17.3 24.55,22.7 | SW144.P$3 24.55,14 | 24.55,14 24.55,17.3 | SW145.P$3 v24.55,10.7 | v24.55,10.7 24.55,14 | SW146.P$3 24.55,7.4 | SW148.P$3 24.25,0.8 24.75,1.3 24.75,4.1 | SW142.P$1 24.55,22.7 | SW141.P$1 24.55,26 | SW140.P$1 24.55,29.3 | SW139.P$1 24.55,32.6 | SW138.P$1 24.75,35.9 | SW137.P$1 24.25,39.2 24.75,38.7 24.75,35.9
  Bottom 0.3: 4.6,14 3.4,14
  Bottom 0.5: CN101.8 3,14 3.4,14 | 4.6,14 4.65,14 11.8,6.85 17,6.85 20.85,10.7 v24.55,10.7
  pour Top: 24.6,2.25 24.6,1 23.5,1 23.5,2.25
  pour Top: 24.6,38.95 24.6,37.75 23.05,37.75 23.05,38.95
R4  (via drill 0.3 pad 0.8)
  Top 0.5: SW159.P$3 30.5,4.1 | 30.5,4.1 30.5,7.2 30.3,7.4 | 30.3,7.4 30.3,10.7 | 30.3,22.7 30.3,26 | 30.3,29.3 30.3,32.6 | 30.3,32.6 30.5,32.8 30.5,35.9 | SW155.P$3 v30.3,17.3 | v30.3,17.3 30.3,22.7 | SW156.P$3 30.3,14 | 30.3,14 v30.3,17.3 | SW157.P$3 30.3,10.7 | 30.3,10.7 30.3,14 | SW158.P$3 30.3,7.4 | SW160.P$3 30,0.8 30.5,1.3 30.5,4.1 | SW154.P$1 30.3,22.7 | SW153.P$1 30.3,26 | 30.3,26 30.3,29.3 | SW152.P$1 30.3,29.3 | SW151.P$1 30.3,32.6 | SW149.P$1 30,39.2 30.5,38.7 30.5,35.9 | SW150.P$1 30.5,35.9
  Bottom 0.5: CN101.9 4.65,15 12.1,7.55 16.7,7.55 19,9.85 | v30.3,17.3 29.8,16.8 23.4,16.8 19,12.4 19,9.85 | 19,9.85
  pour Top: 29,39.2 29.9,39.2 30.45,38.65 30.45,37.75 29,37.75
  pour Top: 28.7,32.45 30.15,32.45 30.15,27.85 28.7,27.85
  pour Top: 28.9,12.15 30.35,12.15 30.35,1.1 28.9,1.1
R5  (via drill 0.3 pad 0.8)
  Top 0.5: v36.05,17.3 36.05,22.7 | 36.05,22.7 36.05,26 | 36.05,26 36.05,29.3 | SW169.P$3 36.05,10.7 | 36.05,10.7 36.05,14 | 36.05,14 v36.05,17.3 | SW170.P$3 35.55,7.4 36.05,7.9 36.05,10.7 | SW167.P$3 v36.05,17.3 | SW168.P$3 36.05,14 | SW164.P$1 36.05,29.3 | SW165.P$1 36.05,26 | SW166.P$1 36.05,22.7 | SW163.P$1 35.55,32.6 36.05,32.1 36.05,29.3 | v14.25,37.15 13.95,36.85 13.95,32.5 13.75,32.3 13.75,8.4 | 13.75,8.4 13.75,7.7 13.95,7.5 13.95,5.85 14.1,5.7 14.1,4.9 13.95,4.75 13.95,3.15 v14.25,2.85 | 13.75,8.4 v13.9,8.4
  Bottom 0.3: 4.6,16 3.4,16
  Bottom 0.5: CN101.10 3,16 3.4,16 | 4.6,16 4.65,16 12.35,8.3 13.8,8.3 v13.9,8.4 14.05,8.25 16.4,8.25 18.3,10.15 18.3,12.69 23.11,17.5 29.3,17.5 29.95,18.15 30.65,18.15 31.5,17.3 v36.05,17.3 | SW161.P$1 14.15,37.05 v14.25,37.15 14.35,37.05 SW162.P$2 | SW172.P$2 14.15,2.95 v14.25,2.85 14.35,2.95 SW171.P$1
  pour Top: 35.8,32.35 34.25,32.35 34.25,24.55 35.8,24.55

### Text on the board
tPlace: = | ⇐ | ↵ | ⇑ | → | - | × | ] | ↑ | ↓ | B | 3.30mm | K | 5 | 0 | P | [ | ' | ← | Ⅲ | 5 | Y | 5 | 9 | O | L | ; | !F | Ⅱ | T | D | 8 | I | K | M | . | Ⅰ | R | M | E | I | 7 | U | J | N | , | ` | W | @ | Q | S | 6 | Y | H | B | !T | \\ | Y | 5 | T | G | V | □ | / | O | E | R | K | 4 | R | F | C | !F | !L | C | 2 | I | 7 | 3 | E | D | X | !A | !E | M | 5.75mm | 2 | W | S | Z | !W | Q | A | ⇑ | !C | 1
bPlace: SW101 | VOL+ | VOL- | SW163 | ← | ← | SW101-160,SW163-170 | → | → | SW170 | Fx | Fy | SW112
_bNames: LED108 | LED107 | LED109 | CN101 | LED110 | LED112 | R104 | LED102 | R103 | R102 | LED101 | R101 | SW161 | SW162 | SW172 | SW171 | LED103 | LED105 | LED106 | LED104 | LED111